# Altium schematic sheet Top Level.SchDoc
size A3
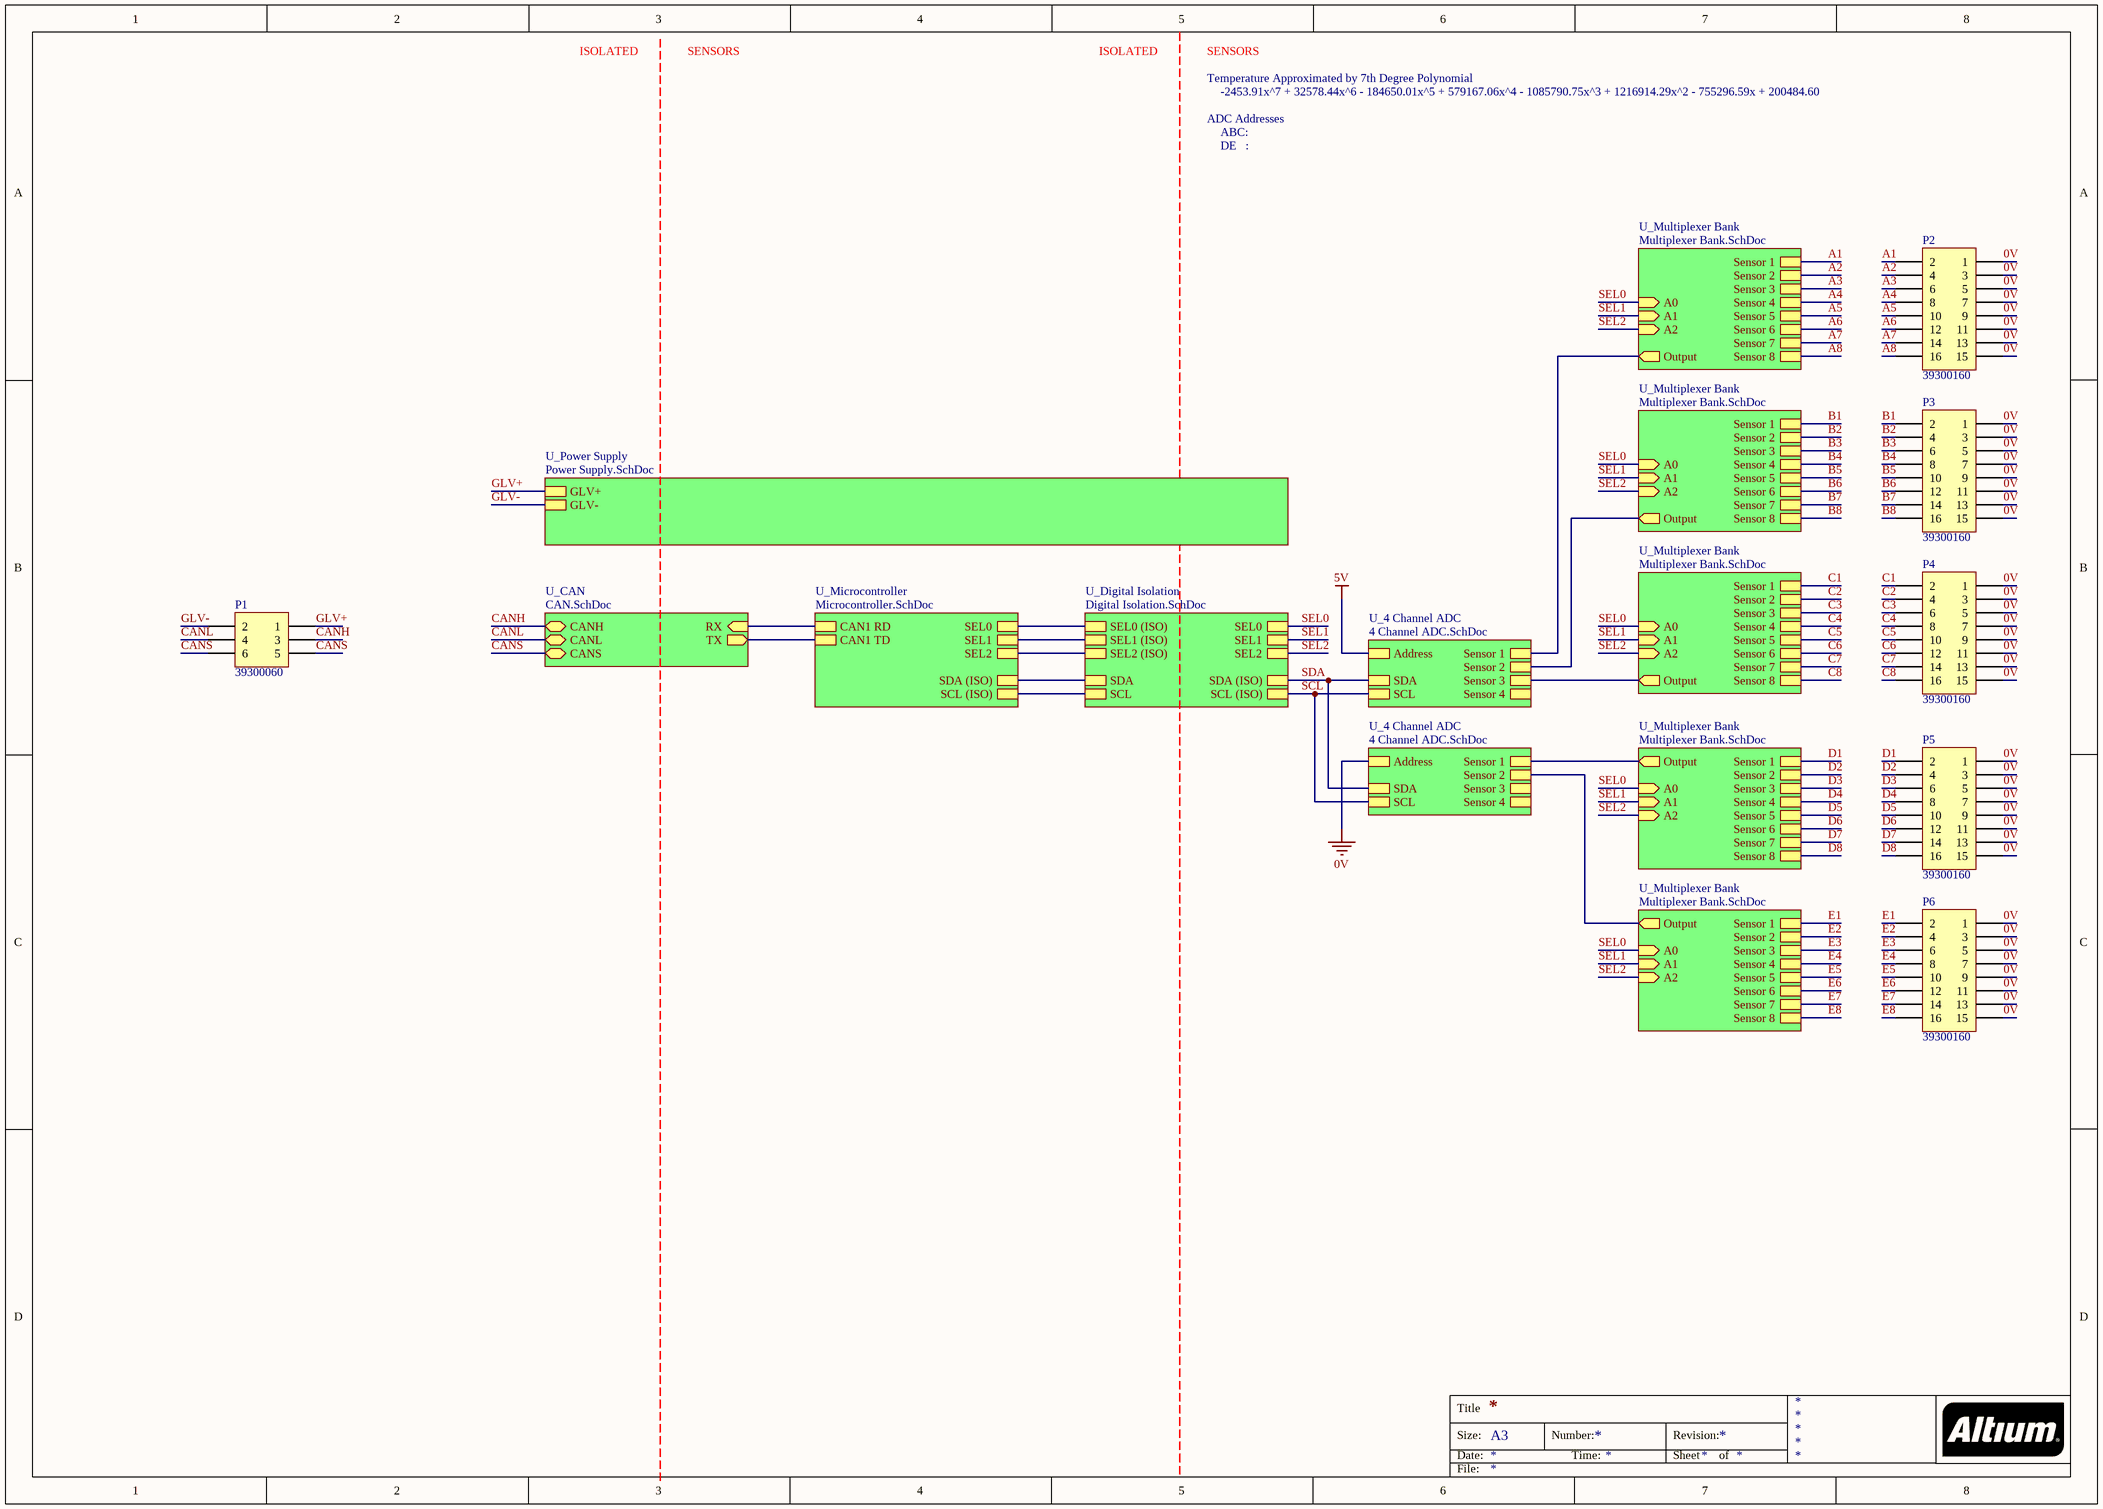
[diagram p0: Top Level.SchDoc]

## Parts
P1  39300060  [39300060]
P2  39300160  [39300160]
P3  39300160  [39300160]
P4  39300160  [39300160]
P5  39300160  [39300160]
P6  39300160  [39300160]

## Sub-sheets
U_4 Channel ADC = 4 Channel ADC.SchDoc: Address, SCL, SDA, Sensor 1, Sensor 2, Sensor 3, Sensor 4
U_4 Channel ADC = 4 Channel ADC.SchDoc: Address, SCL, SDA, Sensor 1, Sensor 2, Sensor 3, Sensor 4
U_CAN = CAN.SchDoc: RX (in), TX (out), CANS (bidir), CANL (bidir), CANH (bidir)
U_Digital Isolation = Digital Isolation.SchDoc: SDA (ISO), SCL (ISO), SDA, SCL, SEL0 (ISO), SEL2 (ISO), SEL1 (ISO), SEL0, SEL2, SEL1
U_Microcontroller = Microcontroller.SchDoc: CAN1 RD, CAN1 TD, SDA (ISO), SCL (ISO), SEL0, SEL1, SEL2
U_Multiplexer Bank = Multiplexer Bank.SchDoc: Output (out), Sensor 7, Sensor 1, Sensor 2, Sensor 3, Sensor 4, Sensor 5, Sensor 6, Sensor 8, A0 (in), A1 (in), A2 (in)
U_Multiplexer Bank = Multiplexer Bank.SchDoc: Output (out), Sensor 7, Sensor 1, Sensor 2, Sensor 3, Sensor 4, Sensor 5, Sensor 6, Sensor 8, A0 (in), A1 (in), A2 (in)
U_Multiplexer Bank = Multiplexer Bank.SchDoc: Output (out), Sensor 7, Sensor 1, Sensor 2, Sensor 3, Sensor 4, Sensor 5, Sensor 6, Sensor 8, A0 (in), A1 (in), A2 (in)
U_Multiplexer Bank = Multiplexer Bank.SchDoc: Output (out), Sensor 7, Sensor 1, Sensor 2, Sensor 3, Sensor 4, Sensor 5, Sensor 6, Sensor 8, A0 (in), A1 (in), A2 (in)
U_Multiplexer Bank = Multiplexer Bank.SchDoc: Output (out), Sensor 7, Sensor 1, Sensor 2, Sensor 3, Sensor 4, Sensor 5, Sensor 6, Sensor 8, A0 (in), A1 (in), A2 (in)
U_Power Supply = Power Supply.SchDoc: GLV+, GLV-

## Nets
0V: P2.1 P2.3 P2.5 P2.7 P2.9 P2.11 P2.13 P2.15 P3.1 P3.3 P3.5 P3.7 P3.9 P3.11 P3.13 P3.15 P4.1 P4.3 P4.5 P4.7 P4.9 P4.11 P4.13 P4.15 P5.1 P5.3 P5.5 P5.7 P5.9 P5.11 P5.13 P5.15 P6.1 P6.3 P6.5 P6.7 P6.9 P6.11 P6.13 P6.15 ; sheet U_4 Channel ADC/Address
5V: sheet U_4 Channel ADC/Address
A1: P2.2 ; sheet U_Multiplexer Bank/Sensor 1
A2: P2.4 ; sheet U_Multiplexer Bank/Sensor 2
A3: P2.6 ; sheet U_Multiplexer Bank/Sensor 3
A4: P2.8 ; sheet U_Multiplexer Bank/Sensor 4
A5: P2.10 ; sheet U_Multiplexer Bank/Sensor 5
A6: P2.12 ; sheet U_Multiplexer Bank/Sensor 6
A7: P2.14 ; sheet U_Multiplexer Bank/Sensor 7
A8: P2.16 ; sheet U_Multiplexer Bank/Sensor 8
B1: P3.2 ; sheet U_Multiplexer Bank/Sensor 1
B2: P3.4 ; sheet U_Multiplexer Bank/Sensor 2
B3: P3.6 ; sheet U_Multiplexer Bank/Sensor 3
B4: P3.8 ; sheet U_Multiplexer Bank/Sensor 4
B5: P3.10 ; sheet U_Multiplexer Bank/Sensor 5
B6: P3.12 ; sheet U_Multiplexer Bank/Sensor 6
B7: P3.14 ; sheet U_Multiplexer Bank/Sensor 7
B8: P3.16 ; sheet U_Multiplexer Bank/Sensor 8
C1: P4.2 ; sheet U_Multiplexer Bank/Sensor 1
C2: P4.4 ; sheet U_Multiplexer Bank/Sensor 2
C3: P4.6 ; sheet U_Multiplexer Bank/Sensor 3
C4: P4.8 ; sheet U_Multiplexer Bank/Sensor 4
C5: P4.10 ; sheet U_Multiplexer Bank/Sensor 5
C6: P4.12 ; sheet U_Multiplexer Bank/Sensor 6
C7: P4.14 ; sheet U_Multiplexer Bank/Sensor 7
C8: P4.16 ; sheet U_Multiplexer Bank/Sensor 8
CANH: P1.3 ; sheet U_CAN/CANH
CANL: P1.4 ; sheet U_CAN/CANL
CANS: P1.5 P1.6 ; sheet U_CAN/CANS
D1: P5.2 ; sheet U_Multiplexer Bank/Sensor 1
D2: P5.4 ; sheet U_Multiplexer Bank/Sensor 2
D3: P5.6 ; sheet U_Multiplexer Bank/Sensor 3
D4: P5.8 ; sheet U_Multiplexer Bank/Sensor 4
D5: P5.10 ; sheet U_Multiplexer Bank/Sensor 5
D6: P5.12 ; sheet U_Multiplexer Bank/Sensor 6
D7: P5.14 ; sheet U_Multiplexer Bank/Sensor 7
D8: P5.16 ; sheet U_Multiplexer Bank/Sensor 8
E1: P6.2 ; sheet U_Multiplexer Bank/Sensor 1
E2: P6.4 ; sheet U_Multiplexer Bank/Sensor 2
E3: P6.6 ; sheet U_Multiplexer Bank/Sensor 3
E4: P6.8 ; sheet U_Multiplexer Bank/Sensor 4
E5: P6.10 ; sheet U_Multiplexer Bank/Sensor 5
E6: P6.12 ; sheet U_Multiplexer Bank/Sensor 6
E7: P6.14 ; sheet U_Multiplexer Bank/Sensor 7
E8: P6.16 ; sheet U_Multiplexer Bank/Sensor 8
GLV+: P1.1 ; sheet U_Power Supply/GLV+
GLV-: P1.2 ; sheet U_Power Supply/GLV-
SCL: sheet U_4 Channel ADC/SCL, sheet U_4 Channel ADC/SCL, sheet U_Digital Isolation/SCL (ISO)
SDA: sheet U_4 Channel ADC/SDA, sheet U_4 Channel ADC/SDA, sheet U_Digital Isolation/SDA (ISO)
SEL0: sheet U_Multiplexer Bank/A0, sheet U_Multiplexer Bank/A0, sheet U_Multiplexer Bank/A0, sheet U_Multiplexer Bank/A0, sheet U_Multiplexer Bank/A0, sheet U_Digital Isolation/SEL0
SEL1: sheet U_Multiplexer Bank/A1, sheet U_Multiplexer Bank/A1, sheet U_Multiplexer Bank/A1, sheet U_Multiplexer Bank/A1, sheet U_Multiplexer Bank/A1, sheet U_Digital Isolation/SEL1
SEL2: sheet U_Multiplexer Bank/A2, sheet U_Multiplexer Bank/A2, sheet U_Multiplexer Bank/A2, sheet U_Multiplexer Bank/A2, sheet U_Multiplexer Bank/A2, sheet U_Digital Isolation/SEL2
(unnamed): sheet U_CAN/RX, sheet U_Microcontroller/CAN1 RD
(unnamed): sheet U_CAN/TX, sheet U_Microcontroller/CAN1 TD
(unnamed): sheet U_4 Channel ADC/Sensor 1, sheet U_Multiplexer Bank/Output
(unnamed): sheet U_4 Channel ADC/Sensor 2, sheet U_Multiplexer Bank/Output
(unnamed): sheet U_Multiplexer Bank/Output, sheet U_4 Channel ADC/Sensor 1
(unnamed): sheet U_Multiplexer Bank/Output, sheet U_4 Channel ADC/Sensor 2
(unnamed): sheet U_Multiplexer Bank/Output, sheet U_4 Channel ADC/Sensor 3
(unnamed): sheet U_Digital Isolation/SDA, sheet U_Microcontroller/SDA (ISO)
(unnamed): sheet U_Digital Isolation/SCL, sheet U_Microcontroller/SCL (ISO)
(unnamed): sheet U_Digital Isolation/SEL0 (ISO), sheet U_Microcontroller/SEL0
(unnamed): sheet U_Digital Isolation/SEL2 (ISO), sheet U_Microcontroller/SEL2
(unnamed): sheet U_Digital Isolation/SEL1 (ISO), sheet U_Microcontroller/SEL1

## Notes on the sheet
- ISOLATED
- SENSORS
- Temperature Approximated by 7th Degree Polynomial
- -2453.91x^7 + 32578.44x^6 - 184650.01x^5 + 579167.06x^4 - 1085790.75x^3 + 1216914.29x^2 - 755296.59x + 200484.60
- ADC Addresses
- ABC:
- DE   :
- Title
- Size:
- Date:
- A3
- Number:
- Time:
- Revision:
- Sheet
- of
- File:

## Library data of the parts
P1 = 39300060: Positions: 6; Pitch: 4.2mm; Row Spacing: 5.5mm; Angle: 90; Flange: No; Contact: Tin; Part Number: 39300060; Digikey Part Number: WM21353-ND
P2-P6 = 39300160: Positions: 16; Pitch: 4.2mm; Row Spacing: 5.5mm; Angle: 90; Flange: No; Contact: Tin; Part Number: 39300160; Digikey Part Number: WM21358-ND